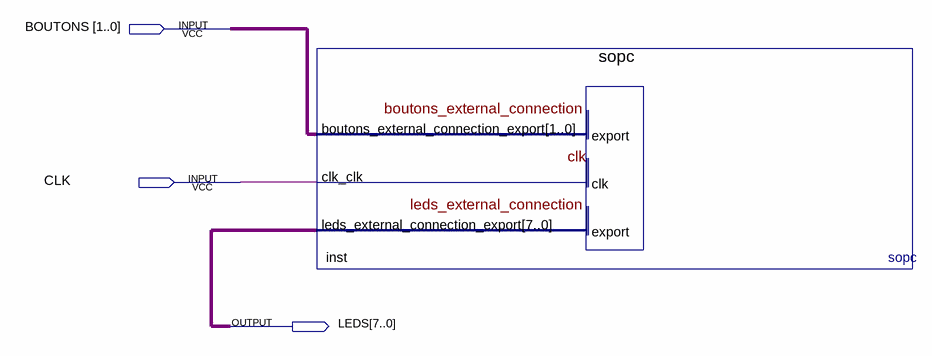
[diagram p0: schematic sheet]
// Quartus schematic sopc_compteur.bdf as structural Verilog: 1 symbols, 3 pins
module sopc_compteur (
  input  [1:0] BOUTONS,
  input  CLK,
  output [7:0] LEDS
);

  sopc inst (.boutons_external_connection_export(BOUTONS), .clk_clk(CLK), .leds_external_connection_export(LEDS));
endmodule
